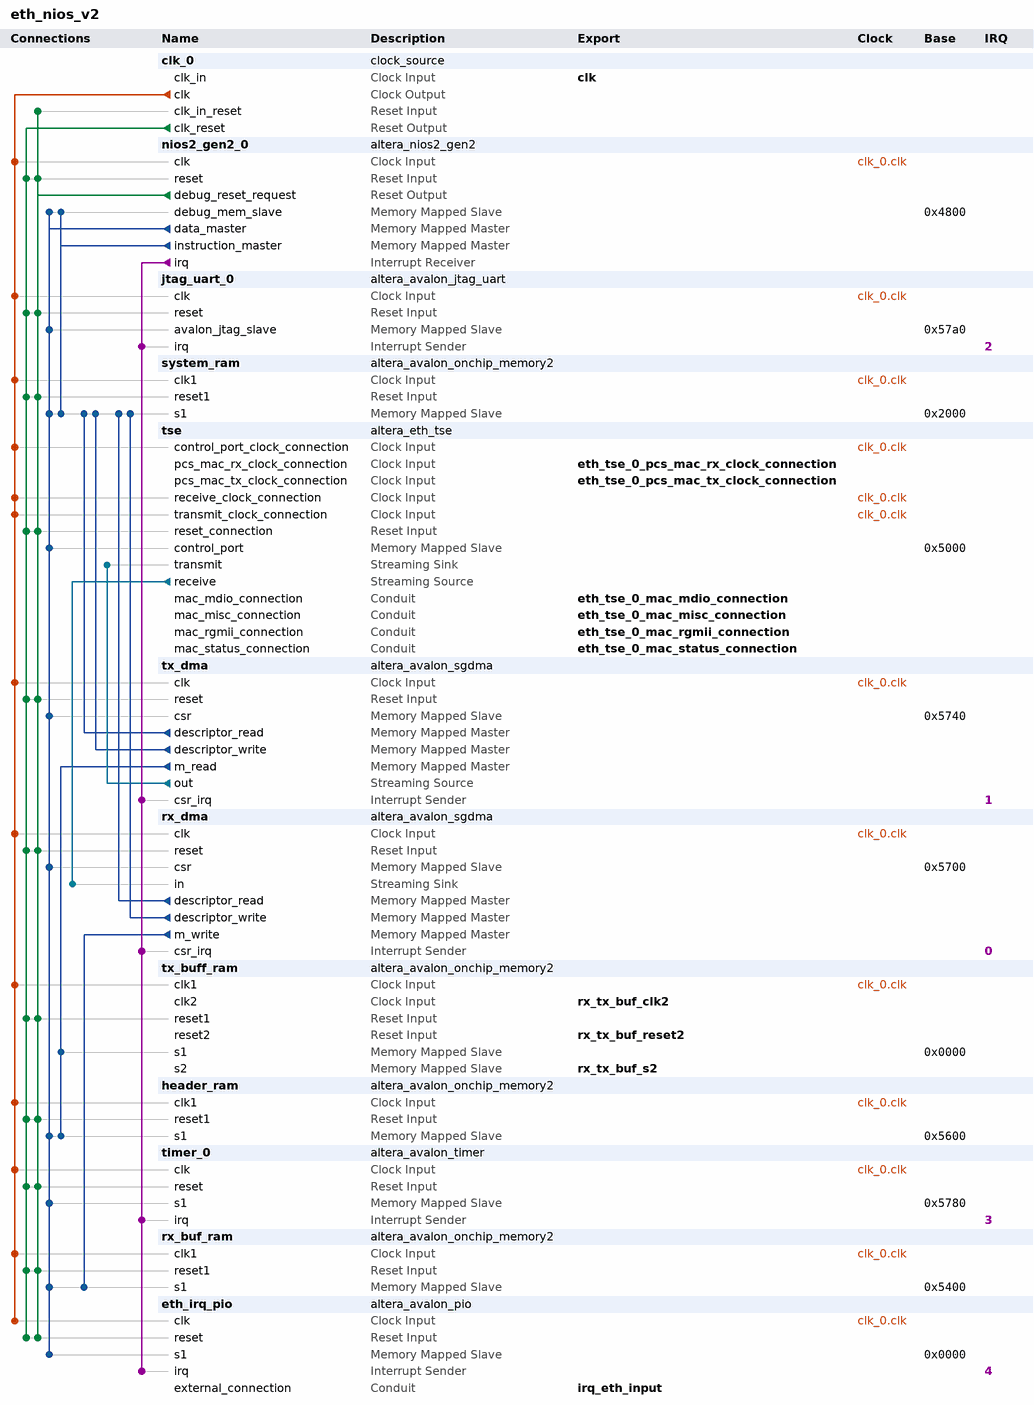
[diagram p0: system contents]
# Platform Designer (Qsys) system eth_nios_v2, Cyclone 10 LP 10CL025YU256I7G
# Parameters at their usual value, and those the tool derives, are not listed.
package require -exact qsys 18.0
create_system eth_nios_v2
set_project_property DEVICE_FAMILY {Cyclone 10 LP}
set_project_property DEVICE 10CL025YU256I7G

add_instance clk_0 clock_source 18.0
set_instance_parameter_value clk_0 clockFrequency 125000000

add_instance nios2_gen2_0 altera_nios2_gen2 18.0
set_instance_parameter_value nios2_gen2_0 dcache_size 2048
set_instance_parameter_value nios2_gen2_0 exceptionSlave system_ram.s1
set_instance_parameter_value nios2_gen2_0 icache_size 4096
set_instance_parameter_value nios2_gen2_0 impl Fast
set_instance_parameter_value nios2_gen2_0 resetSlave system_ram.s1

add_instance jtag_uart_0 altera_avalon_jtag_uart 18.0
set_instance_parameter_value jtag_uart_0 simInteractiveOptions NO_INTERACTIVE_WINDOWS

add_instance system_ram altera_avalon_onchip_memory2 18.0
set_instance_parameter_value system_ram dataWidth 32
set_instance_parameter_value system_ram dualPort false
set_instance_parameter_value system_ram initMemContent true
set_instance_parameter_value system_ram initializationFileName onchip_mem.hex
set_instance_parameter_value system_ram memorySize 8191

add_instance tse altera_eth_tse 18.0
set_instance_parameter_value tse XCVR_RCFG_JTAG_ENABLE 0
set_instance_parameter_value tse XCVR_SET_CAPABILITY_REG_ENABLE 0
set_instance_parameter_value tse XCVR_SET_CSR_SOFT_LOGIC_ENABLE 0
set_instance_parameter_value tse XCVR_SET_PRBS_SOFT_LOGIC_ENABLE 0
set_instance_parameter_value tse XCVR_SET_USER_IDENTIFIER 0
set_instance_parameter_value tse core_variation MAC_ONLY
set_instance_parameter_value tse enable_ena 8
set_instance_parameter_value tse enable_hd_logic false
set_instance_parameter_value tse enable_mac_flow_ctrl false
set_instance_parameter_value tse enable_magic_detect true
set_instance_parameter_value tse enable_shift16 false
set_instance_parameter_value tse ifGMII RGMII
set_instance_parameter_value tse ing_addr 7
set_instance_parameter_value tse mdio_clk_div 256
set_instance_parameter_value tse stat_cnt_ena true
set_instance_parameter_value tse transceiver_type NONE

add_instance tx_dma altera_avalon_sgdma 18.0
set_instance_parameter_value tx_dma enableBurstTransfers false
set_instance_parameter_value tx_dma enableUnalignedTransfers false
set_instance_parameter_value tx_dma readBlockDataWidth 8
set_instance_parameter_value tx_dma sinkErrorWidth 0
set_instance_parameter_value tx_dma sourceErrorWidth 1
set_instance_parameter_value tx_dma transferMode MEMORY_TO_STREAM
set_instance_parameter_value tx_dma writeBurstcountWidth 4

add_instance rx_dma altera_avalon_sgdma 18.0
set_instance_parameter_value rx_dma enableBurstTransfers false
set_instance_parameter_value rx_dma enableUnalignedTransfers false
set_instance_parameter_value rx_dma readBlockDataWidth 8
set_instance_parameter_value rx_dma sinkErrorWidth 1
set_instance_parameter_value rx_dma sourceErrorWidth 0
set_instance_parameter_value rx_dma transferMode STREAM_TO_MEMORY
set_instance_parameter_value rx_dma writeBurstcountWidth 4

add_instance tx_buff_ram altera_avalon_onchip_memory2 18.0
set_instance_parameter_value tx_buff_ram dataWidth 8
set_instance_parameter_value tx_buff_ram dualPort true
set_instance_parameter_value tx_buff_ram initMemContent true
set_instance_parameter_value tx_buff_ram initializationFileName C:/Users/main/Desktop/NIOS_II/eth_ver_2_1/output_files/test.hex
set_instance_parameter_value tx_buff_ram memorySize 2048
set_instance_parameter_value tx_buff_ram useNonDefaultInitFile true

add_instance header_ram altera_avalon_onchip_memory2 18.0
set_instance_parameter_value header_ram dataWidth 8
set_instance_parameter_value header_ram dualPort false
set_instance_parameter_value header_ram initMemContent true
set_instance_parameter_value header_ram initializationFileName onchip_mem.hex
set_instance_parameter_value header_ram memorySize 256

add_instance timer_0 altera_avalon_timer 18.0
set_instance_parameter_value timer_0 period 125000
set_instance_parameter_value timer_0 periodUnits CLOCKS

add_instance rx_buf_ram altera_avalon_onchip_memory2 18.0
set_instance_parameter_value rx_buf_ram dataWidth 8
set_instance_parameter_value rx_buf_ram dualPort false
set_instance_parameter_value rx_buf_ram initMemContent true
set_instance_parameter_value rx_buf_ram initializationFileName onchip_mem.hex
set_instance_parameter_value rx_buf_ram memorySize 512

add_instance eth_irq_pio altera_avalon_pio 18.0
set_instance_parameter_value eth_irq_pio captureEdge true
set_instance_parameter_value eth_irq_pio direction Input
set_instance_parameter_value eth_irq_pio generateIRQ true
set_instance_parameter_value eth_irq_pio irqType EDGE
set_instance_parameter_value eth_irq_pio width 1

# connections
add_connection clk_0.clk eth_irq_pio.clk clock
add_connection clk_0.clk header_ram.clk1 clock
add_connection clk_0.clk jtag_uart_0.clk clock
add_connection clk_0.clk nios2_gen2_0.clk clock
add_connection clk_0.clk rx_buf_ram.clk1 clock
add_connection clk_0.clk rx_dma.clk clock
add_connection clk_0.clk system_ram.clk1 clock
add_connection clk_0.clk timer_0.clk clock
add_connection clk_0.clk tse.control_port_clock_connection clock
add_connection clk_0.clk tse.receive_clock_connection clock
add_connection clk_0.clk tse.transmit_clock_connection clock
add_connection clk_0.clk tx_buff_ram.clk1 clock
add_connection clk_0.clk tx_dma.clk clock
add_connection clk_0.clk_reset eth_irq_pio.reset reset
add_connection clk_0.clk_reset header_ram.reset1 reset
add_connection clk_0.clk_reset jtag_uart_0.reset reset
add_connection clk_0.clk_reset nios2_gen2_0.reset reset
add_connection clk_0.clk_reset rx_buf_ram.reset1 reset
add_connection clk_0.clk_reset rx_dma.reset reset
add_connection clk_0.clk_reset system_ram.reset1 reset
add_connection clk_0.clk_reset timer_0.reset reset
add_connection clk_0.clk_reset tse.reset_connection reset
add_connection clk_0.clk_reset tx_buff_ram.reset1 reset
add_connection clk_0.clk_reset tx_dma.reset reset
add_connection nios2_gen2_0.debug_reset_request clk_0.clk_in_reset reset
add_connection nios2_gen2_0.debug_reset_request eth_irq_pio.reset reset
add_connection nios2_gen2_0.debug_reset_request header_ram.reset1 reset
add_connection nios2_gen2_0.debug_reset_request jtag_uart_0.reset reset
add_connection nios2_gen2_0.debug_reset_request nios2_gen2_0.reset reset
add_connection nios2_gen2_0.debug_reset_request rx_buf_ram.reset1 reset
add_connection nios2_gen2_0.debug_reset_request rx_dma.reset reset
add_connection nios2_gen2_0.debug_reset_request system_ram.reset1 reset
add_connection nios2_gen2_0.debug_reset_request timer_0.reset reset
add_connection nios2_gen2_0.debug_reset_request tse.reset_connection reset
add_connection nios2_gen2_0.debug_reset_request tx_buff_ram.reset1 reset
add_connection nios2_gen2_0.debug_reset_request tx_dma.reset reset
add_connection nios2_gen2_0.data_master eth_irq_pio.s1 avalon
set_connection_parameter_value nios2_gen2_0.data_master/eth_irq_pio.s1 baseAddress 0x0000
add_connection nios2_gen2_0.data_master header_ram.s1 avalon
set_connection_parameter_value nios2_gen2_0.data_master/header_ram.s1 baseAddress 0x5600
add_connection nios2_gen2_0.data_master jtag_uart_0.avalon_jtag_slave avalon
set_connection_parameter_value nios2_gen2_0.data_master/jtag_uart_0.avalon_jtag_slave baseAddress 0x57a0
add_connection nios2_gen2_0.data_master nios2_gen2_0.debug_mem_slave avalon
set_connection_parameter_value nios2_gen2_0.data_master/nios2_gen2_0.debug_mem_slave baseAddress 0x4800
add_connection nios2_gen2_0.data_master rx_buf_ram.s1 avalon
set_connection_parameter_value nios2_gen2_0.data_master/rx_buf_ram.s1 baseAddress 0x5400
add_connection nios2_gen2_0.data_master rx_dma.csr avalon
set_connection_parameter_value nios2_gen2_0.data_master/rx_dma.csr baseAddress 0x5700
add_connection nios2_gen2_0.data_master system_ram.s1 avalon
set_connection_parameter_value nios2_gen2_0.data_master/system_ram.s1 baseAddress 0x2000
add_connection nios2_gen2_0.data_master timer_0.s1 avalon
set_connection_parameter_value nios2_gen2_0.data_master/timer_0.s1 baseAddress 0x5780
add_connection nios2_gen2_0.data_master tse.control_port avalon
set_connection_parameter_value nios2_gen2_0.data_master/tse.control_port baseAddress 0x5000
add_connection nios2_gen2_0.data_master tx_dma.csr avalon
set_connection_parameter_value nios2_gen2_0.data_master/tx_dma.csr baseAddress 0x5740
add_connection nios2_gen2_0.instruction_master nios2_gen2_0.debug_mem_slave avalon
set_connection_parameter_value nios2_gen2_0.instruction_master/nios2_gen2_0.debug_mem_slave baseAddress 0x4800
add_connection nios2_gen2_0.instruction_master system_ram.s1 avalon
set_connection_parameter_value nios2_gen2_0.instruction_master/system_ram.s1 baseAddress 0x2000
add_connection rx_dma.descriptor_read system_ram.s1 avalon
set_connection_parameter_value rx_dma.descriptor_read/system_ram.s1 baseAddress 0x2000
add_connection rx_dma.descriptor_write system_ram.s1 avalon
set_connection_parameter_value rx_dma.descriptor_write/system_ram.s1 baseAddress 0x2000
add_connection rx_dma.m_write rx_buf_ram.s1 avalon
set_connection_parameter_value rx_dma.m_write/rx_buf_ram.s1 baseAddress 0x5400
add_connection tx_dma.descriptor_read system_ram.s1 avalon
set_connection_parameter_value tx_dma.descriptor_read/system_ram.s1 baseAddress 0x2000
add_connection tx_dma.descriptor_write system_ram.s1 avalon
set_connection_parameter_value tx_dma.descriptor_write/system_ram.s1 baseAddress 0x2000
add_connection tx_dma.m_read header_ram.s1 avalon
set_connection_parameter_value tx_dma.m_read/header_ram.s1 baseAddress 0x5600
add_connection tx_dma.m_read tx_buff_ram.s1 avalon
set_connection_parameter_value tx_dma.m_read/tx_buff_ram.s1 baseAddress 0x0000
add_connection tse.receive rx_dma.in avalon_streaming
add_connection tx_dma.out tse.transmit avalon_streaming
add_connection nios2_gen2_0.irq eth_irq_pio.irq interrupt
set_connection_parameter_value nios2_gen2_0.irq/eth_irq_pio.irq irqNumber 4
add_connection nios2_gen2_0.irq jtag_uart_0.irq interrupt
set_connection_parameter_value nios2_gen2_0.irq/jtag_uart_0.irq irqNumber 2
add_connection nios2_gen2_0.irq rx_dma.csr_irq interrupt
set_connection_parameter_value nios2_gen2_0.irq/rx_dma.csr_irq irqNumber 0
add_connection nios2_gen2_0.irq timer_0.irq interrupt
set_connection_parameter_value nios2_gen2_0.irq/timer_0.irq irqNumber 3
add_connection nios2_gen2_0.irq tx_dma.csr_irq interrupt
set_connection_parameter_value nios2_gen2_0.irq/tx_dma.csr_irq irqNumber 1

# exported interfaces
add_interface clk clock sink
set_interface_property clk EXPORT_OF clk_0.clk_in
add_interface eth_tse_0_mac_mdio_connection conduit end
set_interface_property eth_tse_0_mac_mdio_connection EXPORT_OF tse.mac_mdio_connection
add_interface eth_tse_0_mac_misc_connection conduit end
set_interface_property eth_tse_0_mac_misc_connection EXPORT_OF tse.mac_misc_connection
add_interface eth_tse_0_mac_rgmii_connection conduit end
set_interface_property eth_tse_0_mac_rgmii_connection EXPORT_OF tse.mac_rgmii_connection
add_interface eth_tse_0_mac_status_connection conduit end
set_interface_property eth_tse_0_mac_status_connection EXPORT_OF tse.mac_status_connection
add_interface eth_tse_0_pcs_mac_rx_clock_connection clock sink
set_interface_property eth_tse_0_pcs_mac_rx_clock_connection EXPORT_OF tse.pcs_mac_rx_clock_connection
add_interface eth_tse_0_pcs_mac_tx_clock_connection clock sink
set_interface_property eth_tse_0_pcs_mac_tx_clock_connection EXPORT_OF tse.pcs_mac_tx_clock_connection
add_interface irq_eth_input conduit end
set_interface_property irq_eth_input EXPORT_OF eth_irq_pio.external_connection
add_interface rx_tx_buf_clk2 clock sink
set_interface_property rx_tx_buf_clk2 EXPORT_OF tx_buff_ram.clk2
add_interface rx_tx_buf_reset2 reset sink
set_interface_property rx_tx_buf_reset2 EXPORT_OF tx_buff_ram.reset2
add_interface rx_tx_buf_s2 avalon slave
set_interface_property rx_tx_buf_s2 EXPORT_OF tx_buff_ram.s2

set_interconnect_requirement {$system} qsys_mm.clockCrossingAdapter HANDSHAKE
set_interconnect_requirement {$system} qsys_mm.enableEccProtection FALSE
set_interconnect_requirement {$system} qsys_mm.insertDefaultSlave FALSE
set_interconnect_requirement {$system} qsys_mm.maxAdditionalLatency 1

save_system eth_nios_v2.qsys
